# EAGLE design AjoLicht (EAGLE 5.11)
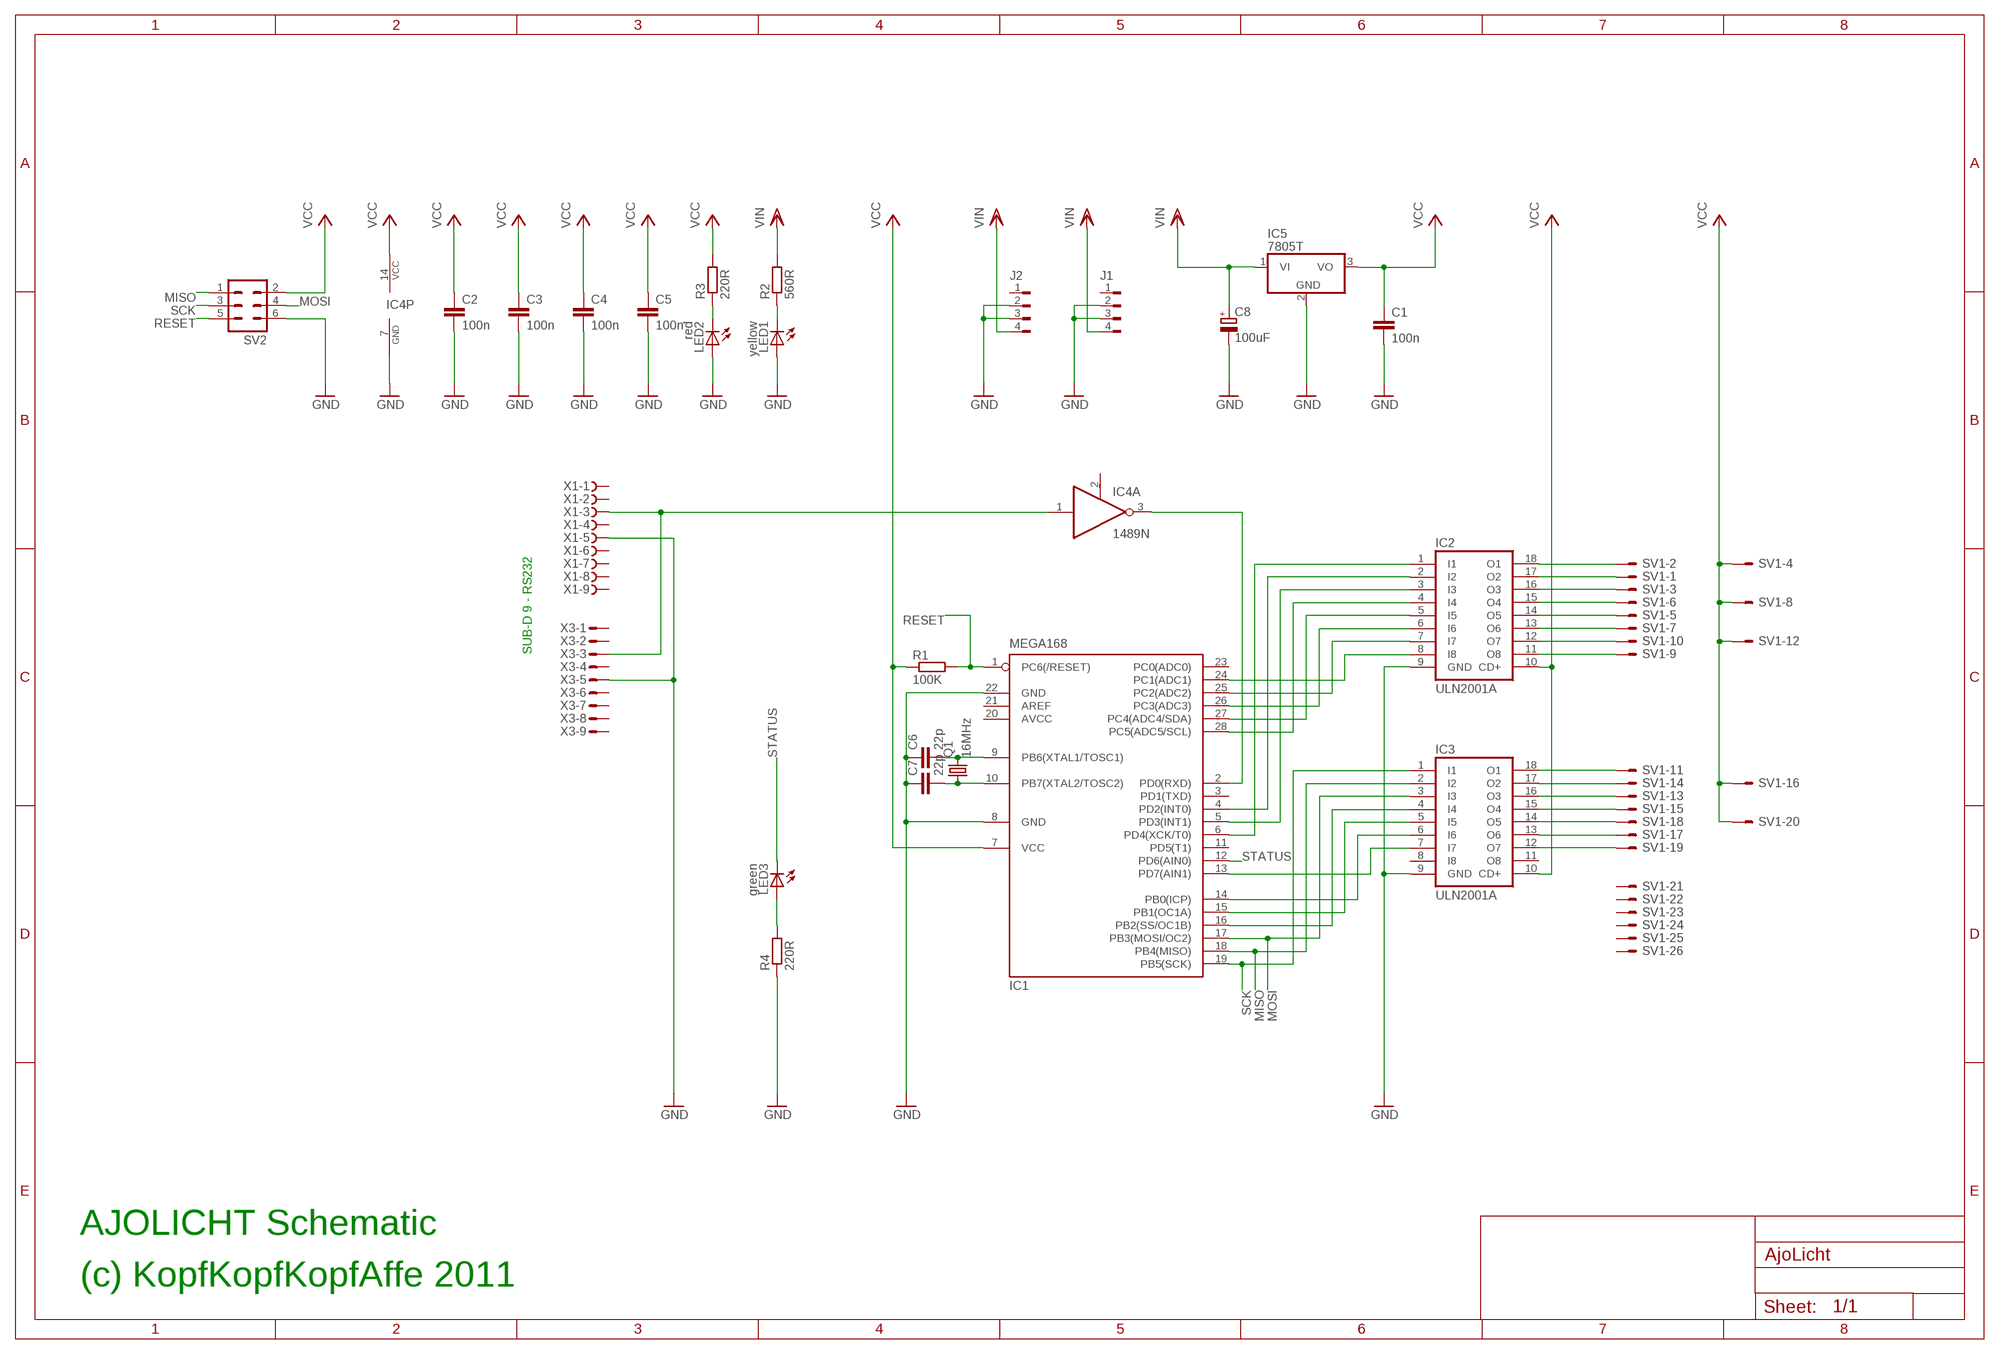
[diagram p0: schematic, sheet 1]

## Parts
C1  100n  C-EU025-024X044  [C025-024X044]
C2  100n  C-EU025-024X044  [C025-024X044]
C3  100n  C-EU025-024X044  [C025-024X044]
C4  100n  C-EU025-024X044  [C025-024X044]
C5  100n  C-EU025-024X044  [C025-024X044]
C6  22p  C-EU025-024X044  [C025-024X044]
C7  22p  C-EU050-024X044  [C050-024X044]
C8  100uF  CPOL-EUE2-5  [E2-5]
IC1  MEGA168  MEGA8-P  [DIL28-3]
IC2  ULN2001A  ULN2803A  [DIL18]
IC3  ULN2001A  ULN2803A  [DIL18]
IC4  1489N  [DIL14]
IC5  7805T  [TO220H]
J1  FLOP-4W827001  [827001]
J2  FLOP-4W827001  [827001]
LED1  yellow  LED3MM  [LED3MM]
LED2  red  LED3MM  [LED3MM]
LED3  green  LED3MM  [LED3MM]
Q1  16MHz  CRYSTALHC49U-H  [HC49U-H]
R1  100K  R-EU_0207/10  [0207/10]
R2  560R  R-EU_0207/10  [0207/10]
R3  220R  R-EU_0207/10  [0207/10]
R4  220R  R-EU_0207/10  [0207/10]
SV1  ML26E  [ML26]
SV2  ML6  [ML6]
X1  F09HS  [F09H]
X3  M09HPS  [M09HP]

## Nets
GND: C1.2 C2.2 C3.2 C4.2 C5.2 C6.1 C7.1 C8.- IC1.8(GND) IC1.22(GND) IC2.9(GND) IC3.9(GND) IC4.7(P:GND) IC5.2(GND) J1.2 J1.3 J2.2 J2.3 LED1.A LED2.A R4.1 SV2.6 X1.5 X3.5
MISO: IC1.18(PB4(MISO)) IC3.2(I2) SV2.1
MOSI: IC1.17(PB3(MOSI/OC2)) IC3.3(I3) SV2.4
N$1: C6.2 IC1.9(PB6(XTAL1/TOSC1)) Q1.2
N$2: C7.2 IC1.10(PB7(XTAL2/TOSC2)) Q1.1
N$3: IC1.28(PC5(ADC5/SCL)) IC2.4(I4)
N$4: IC1.27(PC4(ADC4/SDA)) IC2.5(I5)
N$5: IC1.26(PC3(ADC3)) IC2.6(I6)
N$6: IC1.25(PC2(ADC2)) IC2.7(I7)
N$7: IC1.24(PC1(ADC1)) IC2.8(I8)
N$8: IC1.6(PD4(XCK/T0)) IC2.1(I1)
N$9: IC1.4(PD2(INT0)) IC2.2(I2)
N$10: IC1.5(PD3(INT1)) IC2.3(I3)
N$11: IC1.14(PB0(ICP)) IC3.6(I6)
N$12: IC1.16(PB2(SS/OC1B)) IC3.4(I4)
N$13: IC1.15(PB1(OC1A)) IC3.5(I5)
N$14: IC1.13(PD7(AIN1)) IC3.7(I7)
N$15: IC2.18(O1) SV1.2
N$16: LED2.K(C) R3.1
N$17: IC2.17(O2) SV1.1
N$18: IC2.16(O3) SV1.3
N$19: IC2.15(O4) SV1.6
N$20: IC2.14(O5) SV1.5
N$21: IC2.13(O6) SV1.7
N$22: IC2.12(O7) SV1.10
N$23: IC2.11(O8) SV1.9
N$24: IC3.18(O1) SV1.11
N$25: IC3.17(O2) SV1.14
N$26: IC3.16(O3) SV1.13
N$27: IC3.15(O4) SV1.15
N$28: IC3.14(O5) SV1.18
N$29: IC3.13(O6) SV1.17
N$30: IC3.12(O7) SV1.19
N$31: IC1.2(PD0(RXD)) IC4.3(A:O)
N$32: IC4.1(A:I) X1.3 X3.3
N$33: LED1.K(C) R2.1
N$34: LED3.A R4.2
RESET: IC1.1(PC6(/RESET)) R1.2 SV2.5
SCK: IC1.19(PB5(SCK)) IC3.1(I1) SV2.3
STATUS: IC1.12(PD6(AIN0)) LED3.K(C)
VCC: C1.1 C2.1 C3.1 C4.1 C5.1 IC1.7(VCC) IC2.10(CD+) IC3.10(CD+) IC4.14(P:VCC) IC5.3(VO) R1.1 R3.2 SV1.4 SV1.8 SV1.12 SV1.16 SV1.20 SV2.2
VDD: C8.+ IC5.1(VI) J1.4 J2.4 R2.2 ; supply symbol labelled VIN
Unconnected: IC1.3(PD1(TXD)) IC1.11(PD5(T1)) IC1.21(AREF) IC1.23(PC0(ADC0)) IC3.8(I8) IC3.11(O8) IC4.2(A:RC) IC4.4(B:I) IC4.5(B:RC) IC4.6(B:O) IC4.8(C:O) IC4.9(C:RC) IC4.10(C:I) IC4.11(D:O) IC4.12(D:RC) IC4.13(D:I) J1.1 J2.1 SV1.21 SV1.22 SV1.23 SV1.24 SV1.25 SV1.26 X1.1 X1.2 X1.4 X1.6 X1.7 X1.8 X1.9 X3.1 X3.2 X3.4 X3.6 X3.7 X3.8 X3.9

## Notes on the sheet
- SUB-D 9 - RS232
- AJOLICHT Schematic
- (c) KopfKopfKopfAffe 2011

## Power pins joined to a net without a drawn wire
AVCC: IC1.20(AVCC)

## Library data of the parts
C1-C7 = rcl:C-EU: CAPACITOR, European symbol
C8 = rcl:CPOL-EU: POLARIZED CAPACITOR, European symbol
IC1 = atmel:MEGA8-P: MICROCONTROLLER 8 Kbytes FLASH, 1 kbytes SRAM, 512 bytes EEPROM, USART, 4-channel 10 bit ADC, 2-channel 8 bit ADC Pin compatible with Atmega48, ATMega88, ATMega168 Source: avr.lbr
IC2 IC3 = uln-udn:ULN2803A: DRIVER ARRAY
IC4 = interface:14*89: Quad line receivers BUFFER,
IC5 = linear:78*: Positive VOLTAGE REGULATOR Source: http://cache.national.com/ds/LM/LM78L05.pdf http://www.fairchildsemi.com/ds/LM/LM7805.pdf
J1 J2 = con-amp:FLOP-4W: MATE N-LOCK Floppy / HDD conector Distributor: Bürklin 71F972
LED1-LED3 = led:LED: LED OSRAM: - CHIPLED LG R971, LG N971, LY N971, LG Q971, LY Q971, LO R971, LY R971 LH N974, LH R974 LS Q976, LO Q976, LY Q976 LO Q996 - Hyper CHIPLED LW Q18S LB Q993, LB Q99A, LB R99A - SideLED LS A670, LO A670, LY A670, LG A670, LP A670 LB A673, LV A673, LT A673, LW A673 LH A674 LY A675 LS A676, LA A676, LO A676, LY A676, LW A676 LS A679, LY A679, LG A679 - Hyper Micro SIDELED® LS Y876, LA Y876, LO Y876, LY Y876 LT Y87S - SmartLED LW L88C, LW L88S LB L89C, LB L89S, LG L890 LS L89K, LO L89K, LY L89K LS L896, LA L896, LO L896, LY L896 - TOPLED LS T670, LO T670, LY T670, LG T670, LP T670 LSG T670, LSP T670, LSY T670, LOP T670, LYG T670 LG T671, LOG T671, LSG T671 LB T673, LV T673, LT T673, LW T673 LH T674 LS T676, LA T676, LO T676, LY T676, LB T676, LH T676, LSB T676, LW T676 LB T67C, LV T67C, LT T67C, LS T67K, LO T67K, LY T67K, LW E67C LS E67B, LA E67B, LO E67B, LY E67B, LB E67C, LV E67C, LT E67C LW T67C LS T679, LY T679, LG T679 LS T770, LO T770, LY T770, LG T770, LP T770 LB T773, LV T773, LT T773, LW T773 LH T774 LS E675, LA E675, LY E675, LS T675 LS T776, LA T776, LO T776, LY T776, LB T776 LHGB T686 LT T68C, LB T68C - Hyper Mini TOPLED® LB M676 - Mini TOPLED Santana® LG M470 LS M47K, LO M47K, LY M47K Source: http://www.osram.convergy.de LUXEON: - LUMILED® LXK2-PW12-R00, LXK2-PW12-S00, LXK2-PW14-U00, LXK2-PW14-V00 LXK2-PM12-R00, LXK2-PM12-S00, LXK2-PM14-U00 LXK2-PE12-Q00, LXK2-PE12-R00, LXK2-PE12-S00, LXK2-PE14-T00, LXK2-PE14-U00 LXK2-PB12-K00, LXK2-PB12-L00, LXK2-PB12-M00, LXK2-PB14-N00, LXK2-PB14-P00, LXK2-PB14-Q00 LXK2-PR12-L00, LXK2-PR12-M00, LXK2-PR14-Q00, LXK2-PR14-R00 LXK2-PD12-Q00, LXK2-PD12-R00, LXK2-PD12-S00 LXK2-PH12-R00, LXK2-PH12-S00 LXK2-PL12-P00, LXK2-PL12-Q00, LXK2-PL12-R00 Source: www.luxeon.com KINGBRIGHT: KA-3528ASYC Source: www.kingbright.com
Q1 = crystal:CRYSTAL: CRYSTAL
R1-R4 = resistor:R-EU_: RESISTOR, European symbol
SV1 = con-harting-ml:ML26?E: HARTING
SV2 = con-harting-ml:ML6: HARTING
X1 = con-subd:F09?S: SUB-D
X3 = con-subd:M09?S: SUB-D

## Board
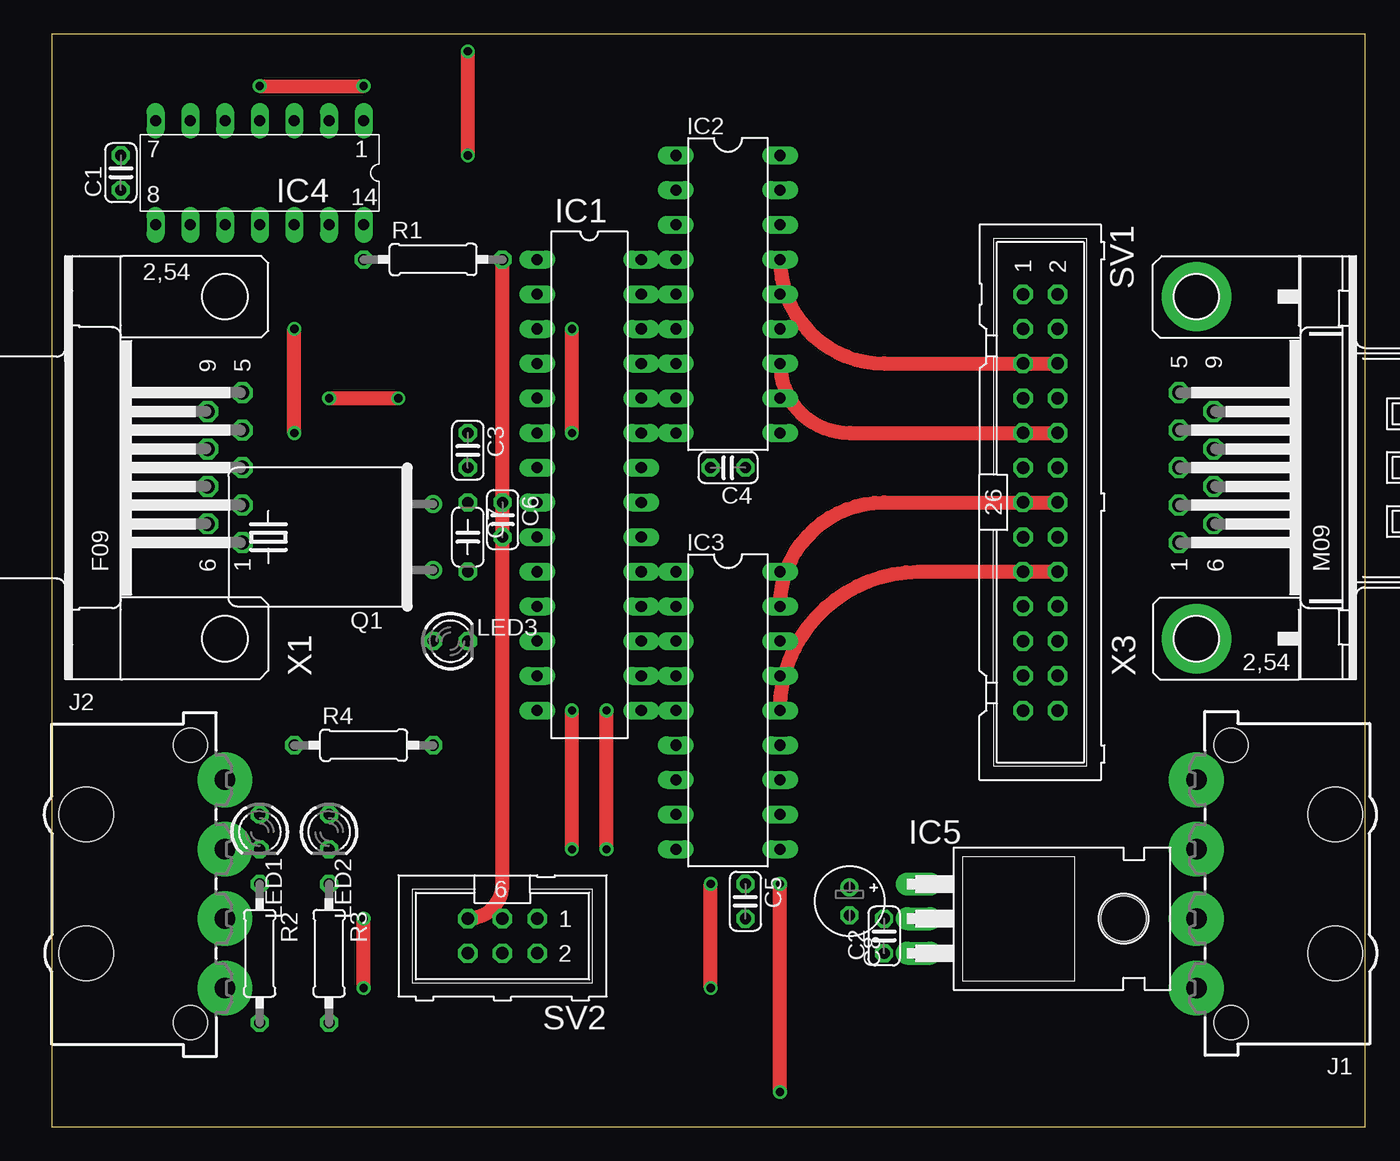
[diagram p1: board, top side]
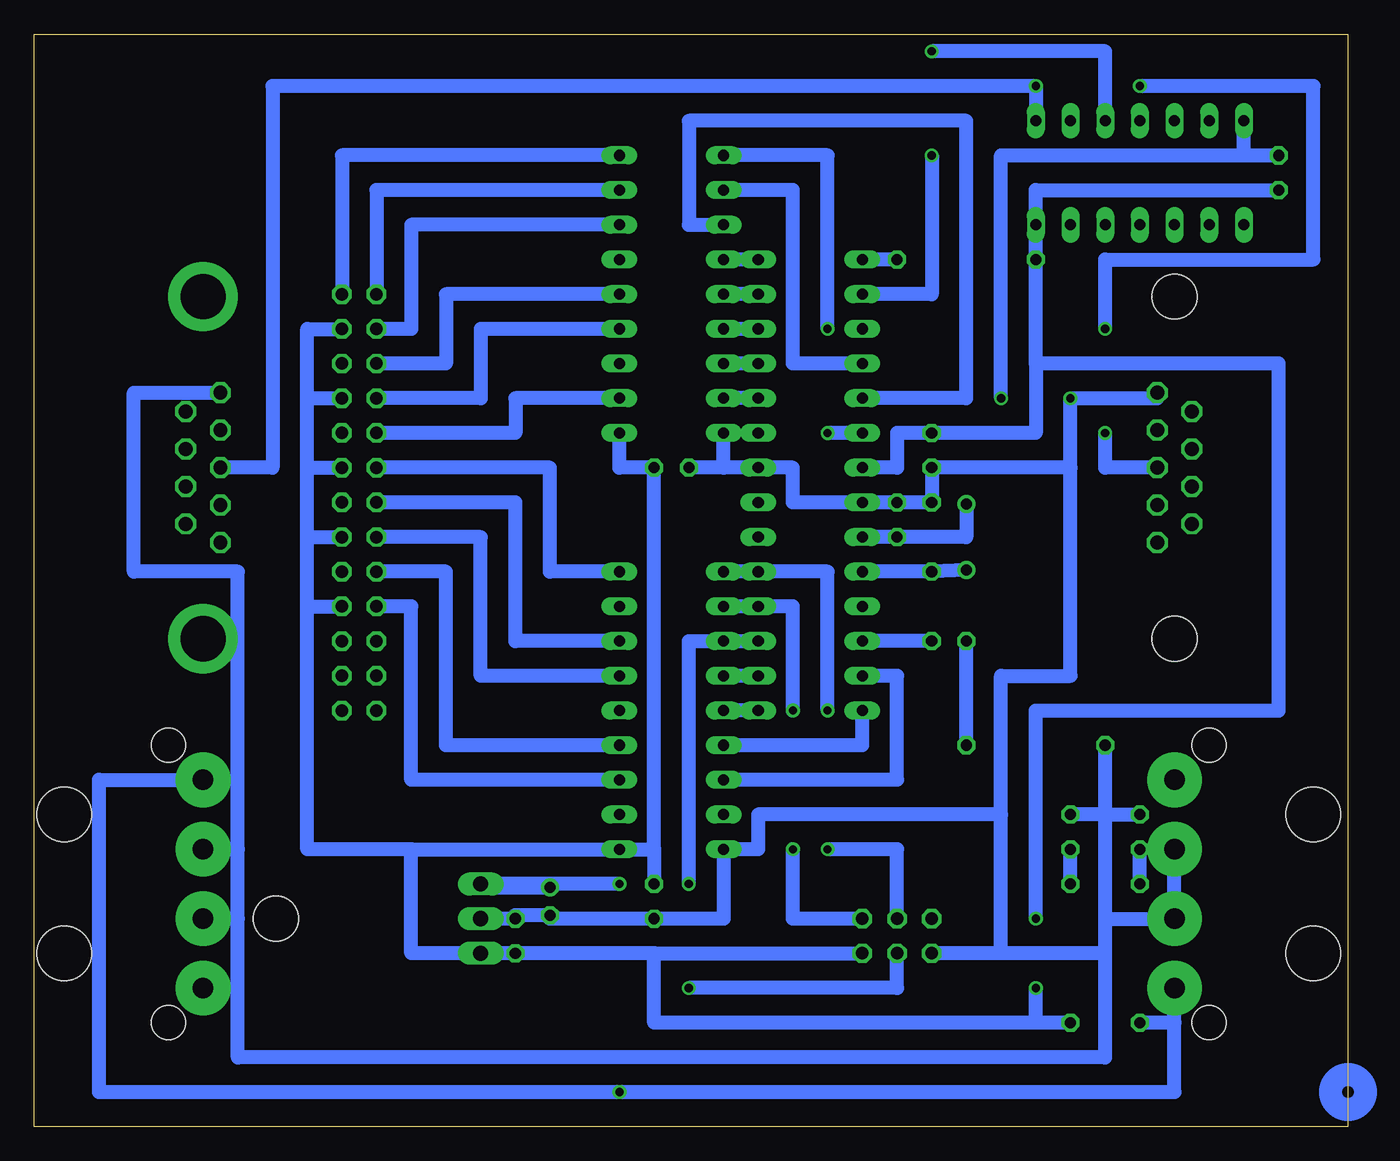
[diagram p2: board, bottom side, seen from below]

Size 96.19 x 80 mm. Coordinates in mm from the lower left corner, seen from the top.
Outline: 0,0 96.19,0 96.19,80 0,80 0,0
Copper layers (1*16): Top 0.035mm / dielectric 1.5mm / Bottom 0.035mm
Design rules "default": minimum track width 10mil, minimum drill 24mil, track to track 8mil, track to pad 8mil, pad to pad 8mil, via to via 8mil, smd to smd 8mil, copper to edge 40mil, drill to drill 8mil, minimum pad ring 10mil, minimum via ring 8mil, stop-mask expansion 4mil, vias tented up to drill 0mil, thermal gap 10mil

### Footprints (pad centres in the part's own frame; a part is rotated, then mirrored left to right if it is on the bottom)
C025-024X044 = drill 0.813 octagon: 1 -1.27,0; 2 1.27,0
C050-024X044 = drill 0.813 octagon: 1 -2.54,0; 2 2.54,0
E2-5 = drill 0.813 pad 1.27 round: + -1.016,0 | drill 0.813 pad 1.27 octagon: - 1.016,0
DIL28-3 = drill 0.813 long: 1 -16.51,-3.81; 2 -13.97,-3.81; 3 -11.43,-3.81; 4 -8.89,-3.81; 5 -6.35,-3.81; 6 -3.81,-3.81; 7 -1.27,-3.81; 8 1.27,-3.81; 9 3.81,-3.81; 10 6.35,-3.81; 11 8.89,-3.81; 12 11.43,-3.81; 13 13.97,-3.81; 14 16.51,-3.81; 15 16.51,3.81; 16 13.97,3.81; 17 11.43,3.81; 18 8.89,3.81; 19 6.35,3.81; 20 3.81,3.81; 21 1.27,3.81; 22 -1.27,3.81; 23 -3.81,3.81; 24 -6.35,3.81; 25 -8.89,3.81; 26 -11.43,3.81; 27 -13.97,3.81; 28 -16.51,3.81
DIL18 = drill 0.813 long: 1 -10.16,-3.81; 2 -7.62,-3.81; 3 -5.08,-3.81; 4 -2.54,-3.81; 5 0,-3.81; 6 2.54,-3.81; 7 5.08,-3.81; 8 7.62,-3.81; 9 10.16,-3.81; 10 10.16,3.81; 11 7.62,3.81; 12 5.08,3.81; 13 2.54,3.81; 14 0,3.81; 15 -2.54,3.81; 16 -5.08,3.81; 17 -7.62,3.81; 18 -10.16,3.81
DIL14 = drill 0.8 long: 1 -7.62,-3.81; 2 -5.08,-3.81; 3 -2.54,-3.81; 4 0,-3.81; 5 2.54,-3.81; 6 5.08,-3.81; 7 7.62,-3.81; 8 7.62,3.81; 9 5.08,3.81; 10 2.54,3.81; 11 0,3.81; 12 -2.54,3.81; 13 -5.08,3.81; 14 -7.62,3.81
TO220H = drill 1.118 long: 1 -2.54,-10.16; 2 0,-10.16; 3 2.54,-10.16 | hole 3.302: 0,4.826
827001 = drill 1.5 pad 4 round: 1 -7.62,0; 2 -2.54,0; 3 2.54,0; 4 7.62,0 | hole 4: 5.08,-10.16; -5.08,-10.16 | hole 2.5: 10.16,-2.54; -10.16,-2.54
LED3MM = drill 0.813 octagon: A -1.27,0; K 1.27,0
HC49U-H = drill 0.813 round: 1 -2.413,-5.08; 2 2.413,-5.08
0207/10 = drill 0.813 octagon: 1 -5.08,0; 2 5.08,0
ML26 = drill 0.914 octagon: 1 -15.24,-1.27; 2 -15.24,1.27; 3 -12.7,-1.27; 4 -12.7,1.27; 5 -10.16,-1.27; 6 -10.16,1.27; 7 -7.62,-1.27; 8 -7.62,1.27; 9 -5.08,-1.27; 10 -5.08,1.27; 11 -2.54,-1.27; 12 -2.54,1.27; 13 0,-1.27; 14 0,1.27; 15 2.54,-1.27; 16 2.54,1.27; 17 5.08,-1.27; 18 5.08,1.27; 19 7.62,-1.27; 20 7.62,1.27; 21 10.16,-1.27; 22 10.16,1.27; 23 12.7,-1.27; 24 12.7,1.27; 25 15.24,-1.27; 26 15.24,1.27
ML6 = drill 0.914 octagon: 1 -2.54,-1.27; 2 -2.54,1.27; 3 0,-1.27; 4 0,1.27; 5 2.54,-1.27; 6 2.54,1.27
F09H = drill 1.016 octagon: 1 -5.486,-1.27; 2 -2.743,-1.27; 3 0,-1.27; 4 2.743,-1.27; 5 5.486,-1.27; 6 -4.115,1.27; 7 -1.372,1.27; 8 1.372,1.27; 9 4.115,1.27 | hole 3.302: -12.522,0; 12.522,0
M09HP = drill 1.016 octagon: 1 -5.486,1.27; 2 -2.743,1.27; 3 0,1.27; 4 2.743,1.27; 5 5.486,1.27; 6 -4.115,-1.27; 7 -1.372,-1.27; 8 1.372,-1.27; 9 4.115,-1.27 | drill 3.302 pad 5.08 round: G1 -12.522,0; G2 12.522,0

### Placement (x,y rotation side)
C1  5.08,69.85 90 top
C2  60.96,13.97 90 top
C3  30.48,49.53 270 top
C4  49.53,48.26 180 top
C5  50.8,16.51 270 top
C6  33.02,44.45 270 top
C7  30.48,43.18 270 top
C8  58.42,16.51 270 top
IC1  39.37,46.99 270 top
IC2  49.53,60.96 270 top
IC3  49.53,30.48 270 top
IC4  15.24,69.85 180 top
IC5  73.66,15.24 270 top
J1  83.82,17.78 90 top
J2  12.7,17.78 270 top
LED1  15.24,21.59 270 top
LED2  20.32,21.59 270 top
LED3  29.21,35.56 0 top
Q1  22.86,43.18 90 top
R1  27.94,63.5 0 top
R2  15.24,12.7 270 top
R3  20.32,12.7 270 top
R4  22.86,27.94 0 top
SV1  72.39,45.72 270 top
SV2  33.02,13.97 180 top
X1  12.7,48.26 90 top
X3  83.82,48.26 90 top

### Tracks (layer width: path | path; a pad name or v marks a point on that pad's centre or on a via)
GND  (via drill 0.6)
  Top 1.016: v20.32,53.34 v25.4,53.34
  Bottom 1.016: 45.72,48.26 IC2.9 | 45.72,48.26 C4.2 | 45.72,48.26 IC1.22 40.64,48.26 40.64,45.72 IC1.8 C6.1 C7.1 C3.2 20.32,48.26 | IC5.2 C2.2 60.96,15.49 C8.- 58.42,15.24 C5.2 45.72,15.24 IC3.9 43.18,20.32 43.18,22.86 25.4,22.86 | 81.28,15.24 81.28,5.08 17.78,5.08 17.78,12.7 | 17.78,12.7 17.78,15.24 | 17.78,15.24 J2.3 J2.2 | 17.78,12.7 25.4,12.7 | 25.4,12.7 SV2.6 | X1.5 13.97,53.34 v20.32,53.34 20.32,48.26 | 7.62,71.12 IC4.7 | 7.62,71.12 C1.2 | 7.62,71.12 25.4,71.12 v25.4,53.34 | 81.28,20.32 J1.3 | 25.4,12.7 25.4,22.86 | 20.32,48.26 20.32,33.02 25.4,33.02 25.4,22.86 | 81.28,15.24 J1.2 | 81.28,15.24 81.28,20.32 | 81.28,20.32 81.28,40.64 88.9,40.64 88.9,53.75 X3.5 | 17.78,22.86 LED2.A | 17.78,22.86 LED1.A | 17.78,15.24 17.78,22.86 | 17.78,22.86 R4.1
MISO  (via drill 0.6)
  Top 1.016: v40.64,20.32 v40.64,30.48
  Bottom 1.016: IC3.2 IC1.18 40.64,38.1 v40.64,30.48 | v40.64,20.32 40.64,15.24 SV2.1
MOSI  (via drill 0.6)
  Top 1.016: v48.26,10.16 v48.26,17.78
  Bottom 1.016: IC1.17 IC3.3 48.26,35.56 v48.26,17.78 | SV2.4 33.02,10.16 v48.26,10.16
N$1
  Bottom 1.016: IC1.9 C6.2 27.94,43.18 Q1.2
N$2
  Bottom 1.016: IC1.10 C7.2 Q1.1
N$3
  Bottom 1.016: IC1.28 IC2.4
N$4
  Bottom 1.016: IC1.27 IC2.5
N$5
  Bottom 1.016: IC1.26 IC2.6
N$6
  Bottom 1.016: IC1.25 IC2.7
N$7
  Bottom 1.016: IC1.24 IC2.8
N$8  (via drill 0.6)
  Top 1.016: v38.1,50.8 v38.1,58.42
  Bottom 1.016: IC2.1 38.1,71.12 v38.1,58.42 | IC1.6 v38.1,50.8
N$9
  Bottom 1.016: IC2.2 40.64,68.58 40.64,55.88 IC1.4
N$10
  Bottom 1.016: IC2.3 48.26,66.04 48.26,73.66 27.94,73.66 27.94,53.34 IC1.5
N$11
  Bottom 1.016: IC3.6 35.56,27.94 IC1.14
N$12
  Bottom 1.016: IC1.16 IC3.4
N$13
  Bottom 1.016: IC1.15 IC3.5
N$14
  Bottom 1.016: IC3.7 33.02,25.4 33.02,33.02 IC1.13
N$15
  Bottom 1.016: IC2.18 73.66,71.12 SV1.2
N$16
  Bottom 1.016: R3.1 LED2.K
N$17
  Bottom 1.016: IC2.17 71.12,68.58 SV1.1
N$18
  Bottom 1.016: IC2.16 68.58,66.04 68.58,58.42 SV1.3
N$19
  Top 1.016: IC2.15 arc90 60.96,55.88 SV1.6
N$20
  Bottom 1.016: IC2.14 66.04,60.96 66.04,55.88 SV1.5
N$21
  Bottom 1.016: SV1.7 63.5,53.34 63.5,58.42 IC2.13
N$22
  Top 1.016: IC2.12 arc90 58.42,50.8 SV1.10
N$23
  Bottom 1.016: IC2.11 60.96,53.34 60.96,50.8 SV1.9
N$24
  Bottom 1.016: IC3.18 58.42,40.64 58.42,48.26 SV1.11
N$25
  Top 1.016: IC3.17 arc-90 60.96,45.72 SV1.14
N$26
  Bottom 1.016: IC3.16 60.96,35.56 60.96,45.72 SV1.13
N$27
  Bottom 1.016: IC3.15 63.5,33.02 63.5,43.18 SV1.15
N$28
  Top 1.016: IC3.14 arc-90 63.5,40.64 SV1.18
N$29
  Bottom 1.016: IC3.13 66.04,27.94 66.04,40.64 SV1.17
N$30
  Bottom 1.016: IC3.12 68.58,25.4 68.58,38.1 SV1.19
N$31  (via drill 0.6)
  Top 1.016: v30.48,78.74 v30.48,71.12
  Bottom 1.016: IC1.2 30.48,60.96 v30.48,71.12 | v30.48,78.74 17.78,78.74 IC4.3
N$32  (via drill 0.6)
  Top 1.016: v17.78,50.8 v17.78,58.42 | v15.24,76.2 v22.86,76.2
  Bottom 1.016: X1.3 17.78,48.26 v17.78,50.8 | v17.78,58.42 17.78,63.5 2.54,63.5 2.54,76.2 v15.24,76.2 | IC4.1 v22.86,76.2 78.74,76.2 78.74,48.26 X3.3
N$33
  Bottom 1.016: R2.1 LED1.K
N$34
  Bottom 1.016: R4.2 LED3.A
RESET
  Top 1.016: SV2.5 arc90 33.02,17.78 R1.2
  Bottom 1.016: R1.2 IC1.1
SCK  (via drill 0.6)
  Top 1.016: v38.1,20.32 v38.1,30.48
  Bottom 1.016: IC3.1 IC1.19 38.1,40.64 v38.1,30.48 | v38.1,20.32 33.02,20.32 SV2.3
STATUS
  Bottom 1.016: LED3.K IC1.12
VCC  (via drill 0.6)
  Top 1.016: v22.86,10.16 v22.86,15.24
  Bottom 1.016: IC2.10 53.34,48.26 C4.1 50.8,20.32 | C1.1 22.86,68.58 IC4.14 R1.1 22.86,55.88 | SV1.4 76.2,58.42 76.2,53.34 | 76.2,53.34 SV1.8 | 76.2,48.26 SV1.12 | 76.2,48.26 76.2,53.34 | 76.2,43.18 SV1.16 | 76.2,43.18 76.2,48.26 | 76.2,38.1 SV1.20 | 76.2,38.1 76.2,43.18 | 68.58,20.32 68.58,12.7 IC5.3 C2.1 50.8,12.7 | 68.58,20.32 IC3.10 50.8,20.32 | 50.8,20.32 C5.1 | 50.8,12.7 SV2.2 | 22.86,55.88 22.86,50.8 C3.1 33.02,50.8 33.02,48.26 IC1.7 | 22.86,7.62 50.8,7.62 50.8,12.7 | 22.86,7.62 v22.86,10.16 | v22.86,15.24 22.86,30.48 5.08,30.48 5.08,55.88 22.86,55.88 | 76.2,38.1 76.2,20.32 68.58,20.32 | R3.2 22.86,7.62
VDD  (via drill 0.6)
  Top 1.016: v53.34,2.54 v53.34,17.78
  Bottom 1.016: J1.4 91.44,25.4 91.44,2.54 v53.34,2.54 12.7,2.54 12.7,7.62 | 12.7,7.62 J2.4 | 58.42,17.78 C8.+ 63.5,17.53 IC5.1 v53.34,17.78 | 12.7,7.62 R2.2
(copper drawn outside any net)
  shapes: Bottom circle x1

### Text on the board
Document: AJOLICHT Board Layout for Protoboard. | Straight top layer traces can be implemented by wire bridges or zero-ohm resistors | Bent top layer traces should be implemented by wires | (c) KopfKopfKopfAffe 2011